# EAGLE schematic miniprinter-sanguinololu-longboard (EAGLE 9.4.2)
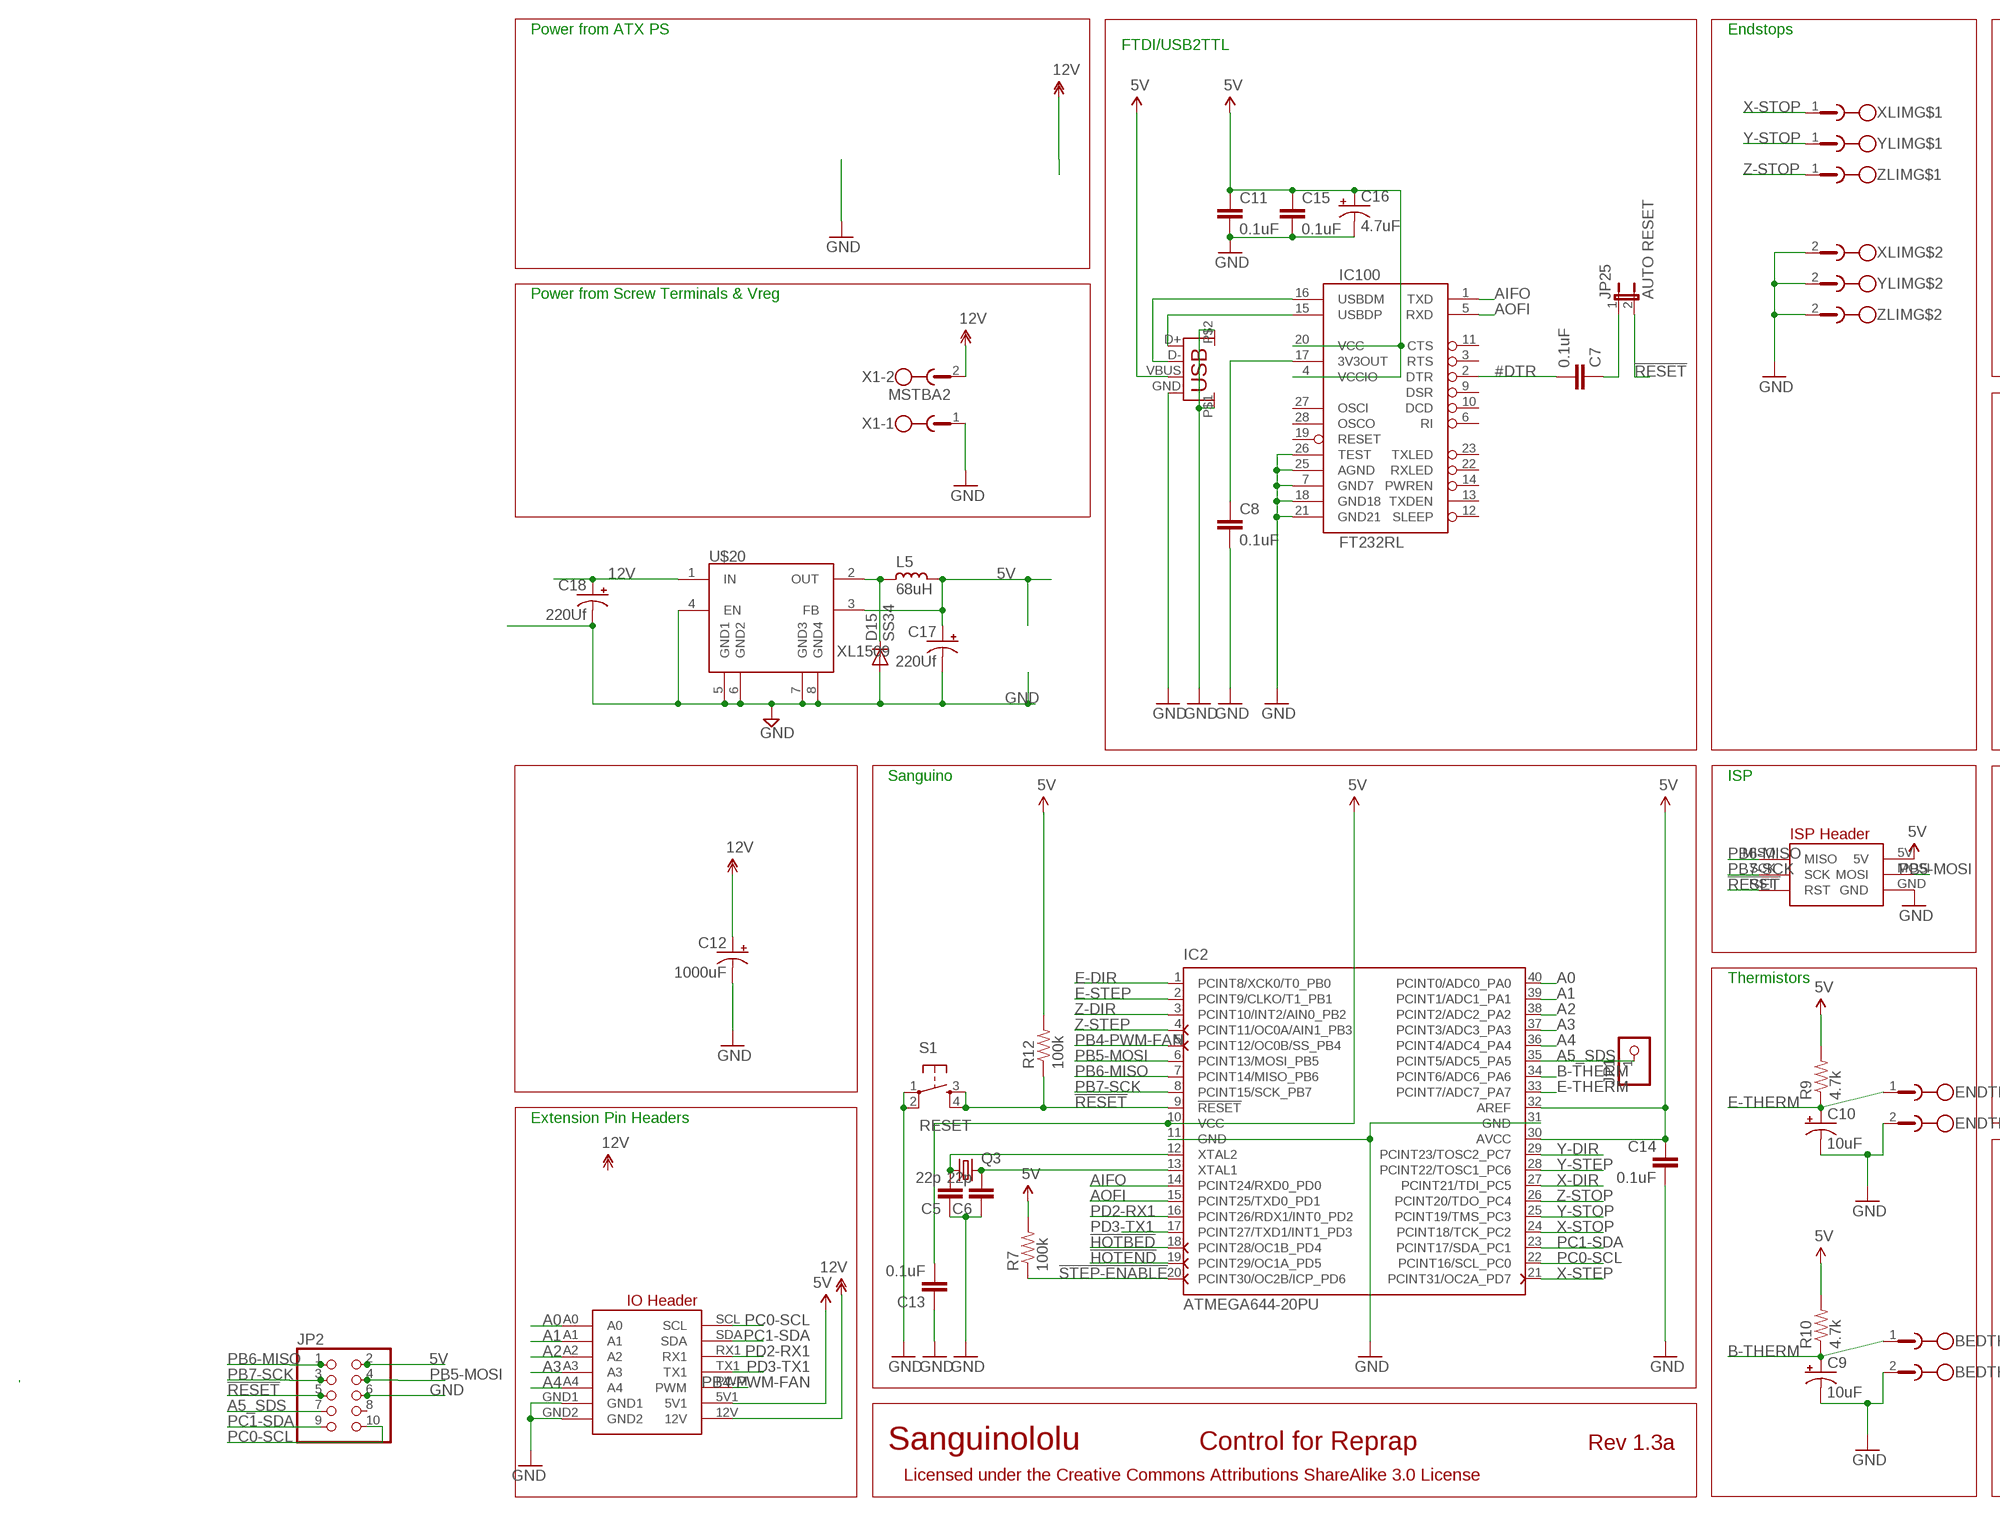
[diagram p0: schematic, sheet 1, part 1 of 2]
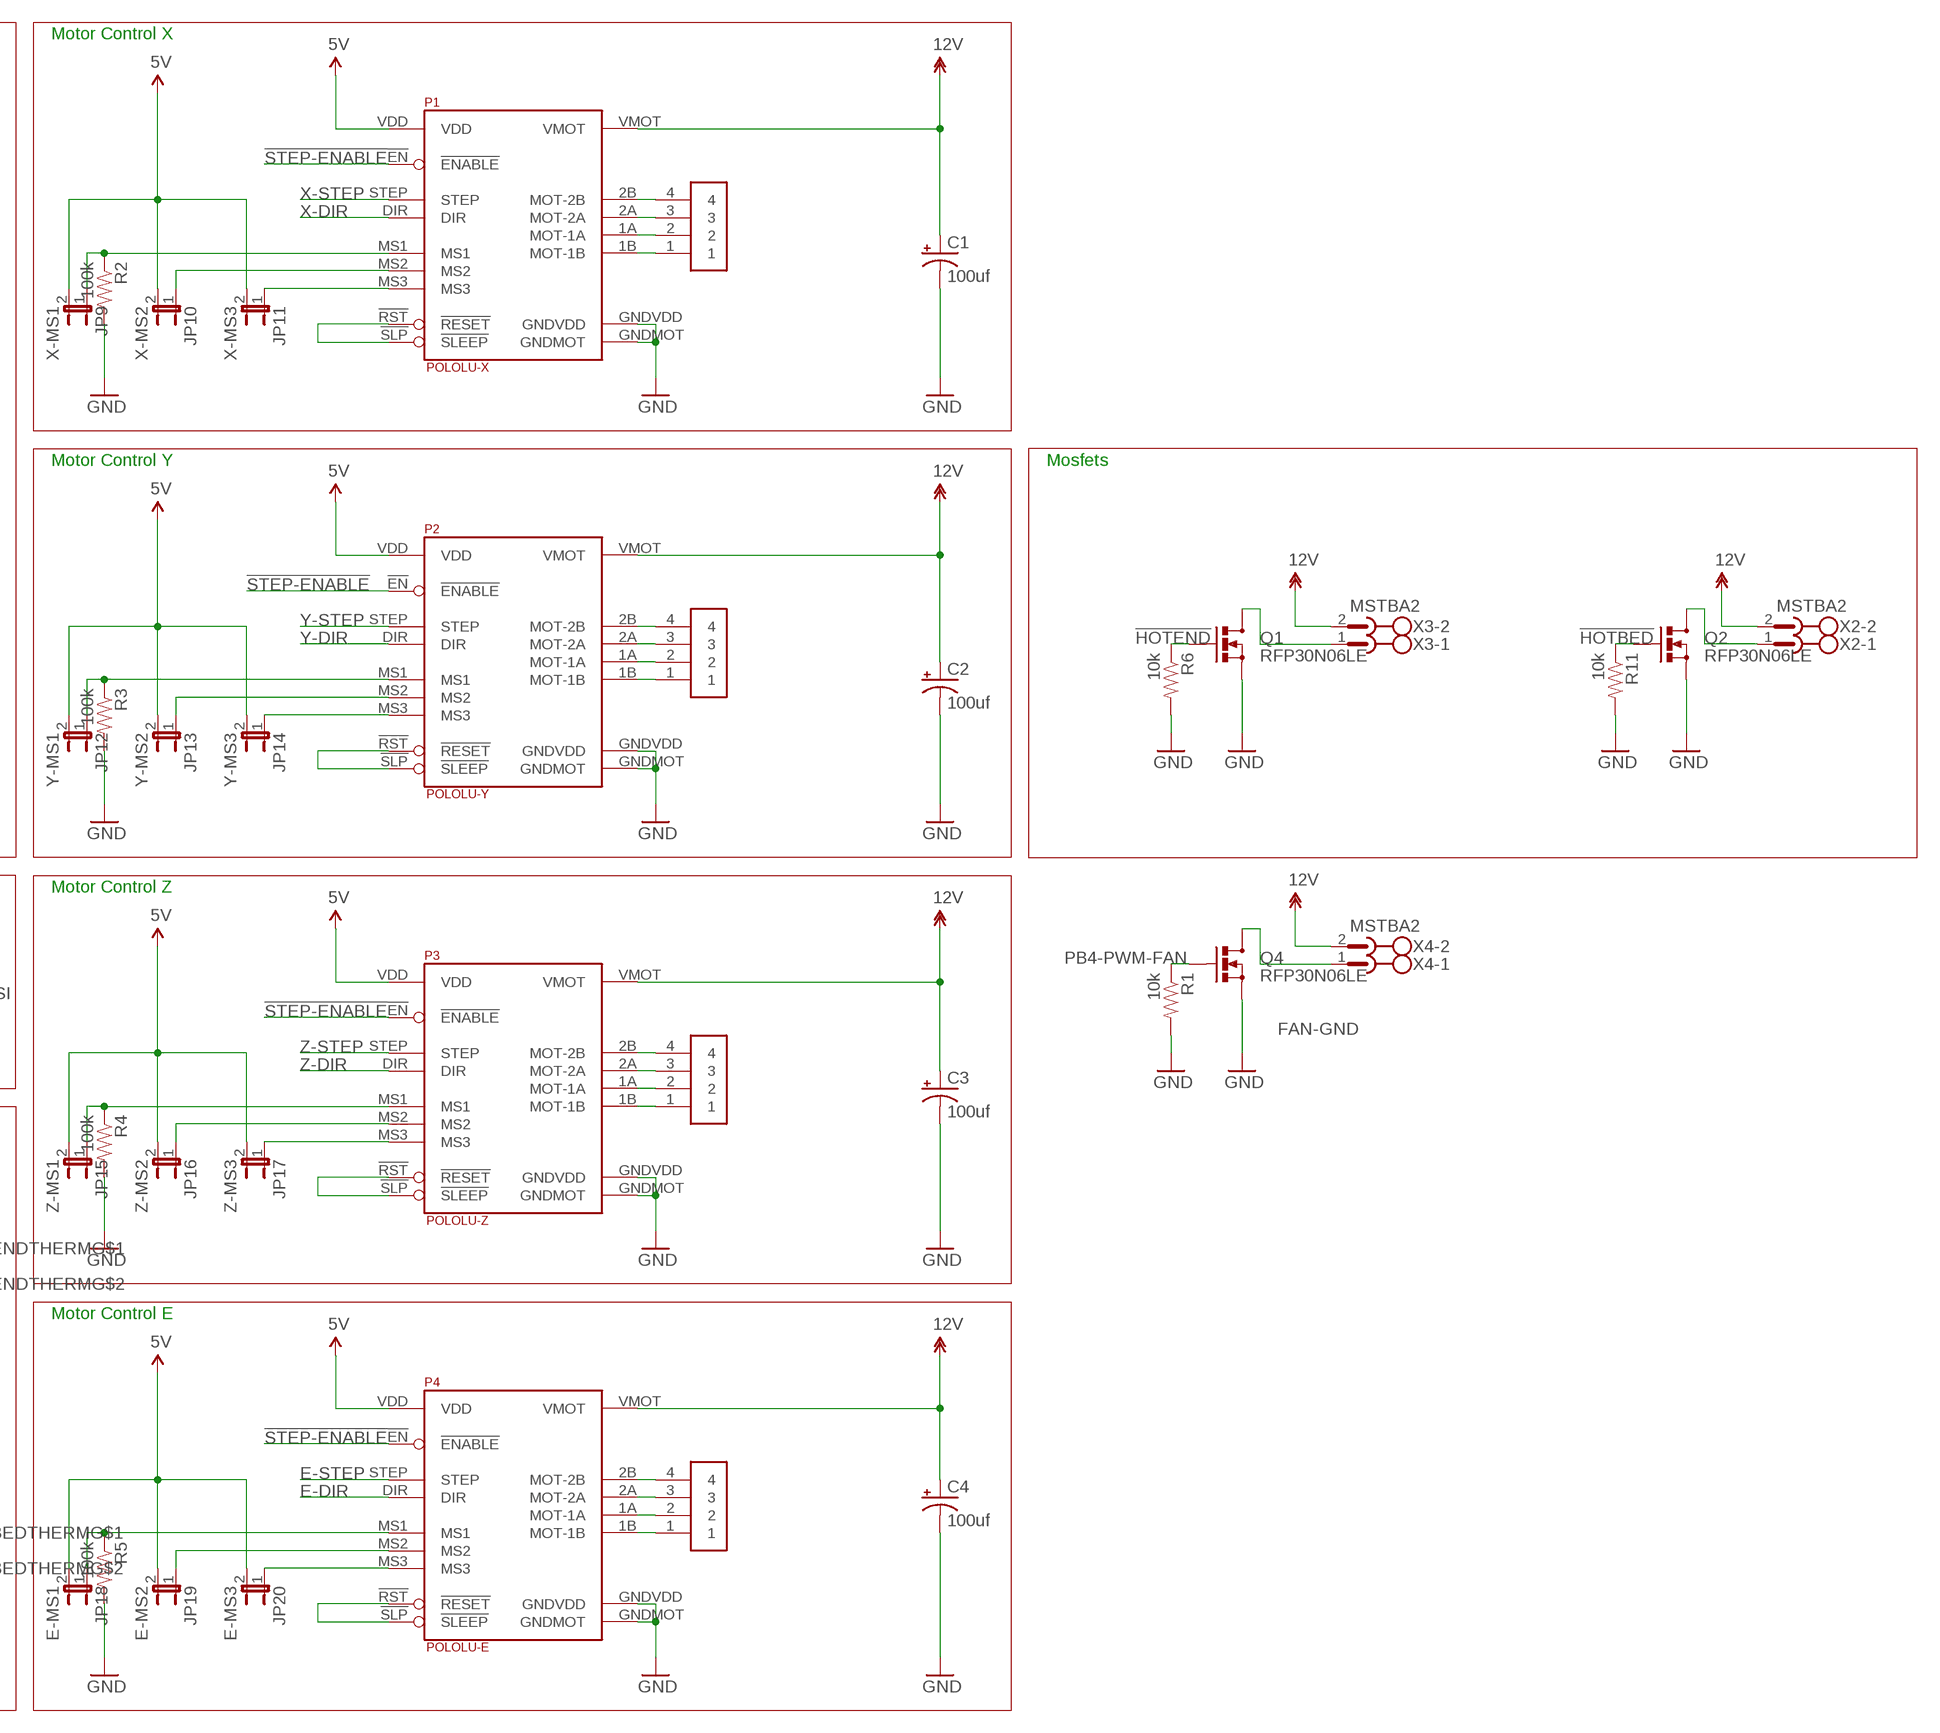
[diagram p1: schematic, sheet 1, part 2 of 2]

## Parts
BEDTHERM  Phoenix Pluggable 3.81mm 2 way  MC1.5/2  [MC1.5/2-G-3.81]
C1  100uf  CAP_POLPTH1  [CPOL-RADIAL-100UF-25V]
C2  100uf  CAP_POLPTH1  [CPOL-RADIAL-100UF-25V]
C3  100uf  CAP_POLPTH1  [CPOL-RADIAL-100UF-25V]
C4  100uf  CAP_POLPTH1  [CPOL-RADIAL-100UF-25V]
C5  22p  CAPPTH2  [CAP-PTH-SMALL2]
C6  22p  CAPPTH2  [CAP-PTH-SMALL2]
C7  0.1uF  CAPPTH2  [CAP-PTH-SMALL2]
C8  0.1uF  CAPPTH2  [CAP-PTH-SMALL2]
C9  10uF  CAP_POLPTH2  [CPOL-RADIAL-10UF-25V]
C10  10uF  CAP_POLPTH2  [CPOL-RADIAL-10UF-25V]
C11  0.1uF  CAPPTH2  [CAP-PTH-SMALL2]
C12  1000uF  CAP_POLPTH4  [CPOL-RADIAL-1000UF-25V]
C13  0.1uF  CAPPTH2  [CAP-PTH-SMALL2]
C14  0.1uF  CAPPTH2  [CAP-PTH-SMALL2]
C15  0.1uF  CAPPTH2  [CAP-PTH-SMALL2]
C16  4.7uF  CAP_POLPTH2  [CPOL-RADIAL-10UF-25V]
C17  220Uf  CAP_POLPTH1  [CPOL-RADIAL-100UF-25V]
C18  220Uf  CAP_POLPTH1  [CPOL-RADIAL-100UF-25V]
D15  SS34  DIODE-DO-214AC  [DO-214AC]
ENDTHERM  Phoenix Pluggable 3.81mm 2 way  MC1.5/2  [MC1.5/2-G-3.81]
IC2  ATMEGA644-20PU  [DIL40]
IC100  FT232RL  FT232RLSSOP  [SSOP28DB]
J1  USB  USBPTH  [USB-B-PTH]
JP1  PINHD-1X1  [1X01]
JP2  PINHD-2X5  [2X05]
JP9  X-MS1  JUMPER-2PTH  [1X02]
JP10  X-MS2  JUMPER-2PTH  [1X02]
JP11  X-MS3  JUMPER-2PTH  [1X02]
JP12  Y-MS1  JUMPER-2PTH  [1X02]
JP13  Y-MS2  JUMPER-2PTH  [1X02]
JP14  Y-MS3  JUMPER-2PTH  [1X02]
JP15  Z-MS1  JUMPER-2PTH  [1X02]
JP16  Z-MS2  JUMPER-2PTH  [1X02]
JP17  Z-MS3  JUMPER-2PTH  [1X02]
JP18  E-MS1  JUMPER-2PTH  [1X02]
JP19  E-MS2  JUMPER-2PTH  [1X02]
JP20  E-MS3  JUMPER-2PTH  [1X02]
JP25  AUTO RESET  JUMPER-2PTH  [1X02]
L5  68uH  L_CD75  [CD75]
P1  POLOLU-X  POLOLU-ALLEGRO  [POLOLU-ALLEGRO-PTH]
P2  POLOLU-Y  POLOLU-ALLEGRO  [POLOLU-ALLEGRO-PTH]
P3  POLOLU-Z  POLOLU-ALLEGRO  [POLOLU-ALLEGRO-PTH]
P4  POLOLU-E  POLOLU-ALLEGRO  [POLOLU-ALLEGRO-PTH]
Q1  RFP30N06LE  MOSFET-NCHANNELPTH2  [TO220V]
Q2  RFP30N06LE  MOSFET-NCHANNELPTH2  [TO220V]
Q3  CRYSTALHC49S  [HC49/S]
Q4  RFP30N06LE  MOSFET-NCHANNELPTH2  [TO220V]
R1  10k  RESISTORPTH1  [AXIAL-0.3]
R2  100k  RESISTORPTH1  [AXIAL-0.3]
R3  100k  RESISTORPTH1  [AXIAL-0.3]
R4  100k  RESISTORPTH1  [AXIAL-0.3]
R5  100k  RESISTORPTH1  [AXIAL-0.3]
R6  10k  RESISTORPTH1  [AXIAL-0.3]
R7  100k  RESISTORPTH1  [AXIAL-0.3]
R9  4.7k  RESISTORPTH1  [AXIAL-0.3]
R10  4.7k  RESISTORPTH1  [AXIAL-0.3]
R11  10k  RESISTORPTH1  [AXIAL-0.3]
R12  100k  RESISTORPTH1  [AXIAL-0.3]
S1  RESET  TAC_SWITCHPTH  [TACTILE-PTH]
U$17  CONNECTOR-M4  [3.81MM-4WAY-PLUGGABLE-SCREW]
U$20  XL1509  [SO08]
U$24  IO_HEADERS_SCREW  [IO_HEADER-PLATEDSCREW]
U$25  CONNECTOR-M4  [3.81MM-4WAY-PLUGGABLE-SCREW]
U$26  CONNECTOR-M4  [3.81MM-4WAY-PLUGGABLE-SCREW]
U$27  CONNECTOR-M4  [3.81MM-4WAY-PLUGGABLE-SCREW]
X1  MSTBA2  [MSTBA2]
X2  MSTBA2  [MSTBA2]
X3  MSTBA2  [MSTBA2]
X4  MSTBA2  [MSTBA2]
XLIM  Phoenix Pluggable 3.81mm 2 way  MC1.5/2  [MC1.5/2-G-3.81]
YLIM  Phoenix Pluggable 3.81mm 2 way  MC1.5/2  [MC1.5/2-G-3.81]
ZLIM  Phoenix Pluggable 3.81mm 2 way  MC1.5/2  [MC1.5/2-G-3.81]

## Nets
3V3: C8.1 IC100.17(3V3OUT)
5V: C11.1 C13.2 C14.1 C15.1 C16.1(+) C17.1(+) IC2.10(VCC) IC2.30(AVCC) IC2.32(AREF) IC100.4(VCCIO) IC100.20(VCC) J1.VBUS JP2.2 JP9.2 JP10.2 JP11.2 JP12.2 JP13.2 JP14.2 JP15.2 JP16.2 JP17.2 JP18.2 JP19.2 JP20.2 L5.1 P1.VDD P2.VDD P3.VDD P4.VDD R7.P$2 R9.P$2 R10.P$2 R12.P$2 U$20.3(FB) U$24.5V U$24.5V1
12V: C1.1(+) C2.1(+) C3.1(+) C4.1(+) C12.1(+) C18.1(+) P1.VMOT P2.VMOT P3.VMOT P4.VMOT U$20.1(IN) U$24.12V X1.2 X2.2 X3.2 X4.2
!FTDI-RESET: C7.1 JP25.1
!HOTBED: IC2.18(PCINT28/OC1B_PD4) Q2.1(G) R11.P$1
!HOTEND: IC2.19(PCINT29/OC1A_PD5) Q1.1(G) R6.P$1
!RESET: IC2.9(!RESET) JP2.5 JP25.2 R12.P$1 S1.3 S1.4 U$24.RST
!STEP-ENABLE: IC2.20(PCINT30/OC2B/ICP_PD6) P1.!EN(!ENABLE) P2.!EN(!ENABLE) P3.!EN(!ENABLE) P4.!EN(!ENABLE) R7.P$1
#DTR: C7.2 IC100.2(DTR)
A0: IC2.40(PCINT0/ADC0_PA0) U$24.A0
A1: IC2.39(PCINT1/ADC1_PA1) U$24.A1
A2: IC2.38(PCINT2/ADC2_PA2) U$24.A2
A3: IC2.37(PCINT3/ADC3_PA3) U$24.A3
A4: IC2.36(PCINT4/ADC4_PA4) U$24.A4
A5_SDS: IC2.35(PCINT5/ADC5_PA5) JP1.1 JP2.7
AIFO: IC2.14(PCINT24/RXD0_PD0) IC100.1(TXD)
AOFI: IC2.15(PCINT25/TXD0_PD1) IC100.5(RXD)
B-THERM: BEDTHERM.1 C9.1(+) IC2.34(PCINT6/ADC6_PA6) R10.P$1
E-DIR: IC2.1(PCINT8/XCK0/T0_PB0) P4.DIR
E-MS1: JP18.1 P4.MS1 R5.P$1
E-MS2: JP19.1 P4.MS2
E-MS3: JP20.1 P4.MS3
E-RESETSLEEP: P4.!RST(!RESET) P4.!SLP(!SLEEP)
E-STEP: IC2.2(PCINT9/CLKO/T1_PB1) P4.STEP
E-THERM: C10.1(+) ENDTHERM.1 IC2.33(PCINT7/ADC7_PA7) R9.P$1
FAN-GND [power]: Q4.2(D) X4.1
GND [power]: BEDTHERM.2 C1.2(-) C2.2(-) C3.2(-) C4.2(-) C5.1 C6.1 C8.2 C9.2(-) C10.2(-) C11.2 C12.2(-) C13.1 C14.2 C15.2 C16.2(-) C17.2(-) C18.2(-) D15.2(A) ENDTHERM.2 IC2.11(GND) IC2.31(GND) IC100.7(GND7) IC100.18(GND18) IC100.21(GND21) IC100.25(AGND) IC100.26(TEST) J1.GND J1.P$1 J1.P$2 JP2.6 P1.GNDMOT P1.GNDVDD P2.GNDMOT P2.GNDVDD P3.GNDMOT P3.GNDVDD P4.GNDMOT P4.GNDVDD Q1.3(S) Q2.3(S) Q4.3(S) R1.P$2 R2.P$2 R3.P$2 R4.P$2 R5.P$2 R6.P$2 R11.P$2 S1.1 S1.2 U$20.4(EN) U$20.5(GND1) U$20.6(GND2) U$20.7(GND3) U$20.8(GND4) U$24.GND U$24.GND1 U$24.GND2 X1.1 XLIM.2 YLIM.2 ZLIM.2
HOTBED-GND [power]: Q2.2(D) X2.1
HOTEND-GND [power]: Q1.2(D) X3.1
N$1: P4.1B(MOT-1B) U$27.1
N$3: P4.1A(MOT-1A) U$27.2
N$4: P4.2A(MOT-2A) U$27.3
N$5: P4.2B(MOT-2B) U$27.4
N$6: P3.1B(MOT-1B) U$26.1
N$7: P3.1A(MOT-1A) U$26.2
N$8: P3.2A(MOT-2A) U$26.3
N$9: P3.2B(MOT-2B) U$26.4
N$10: P2.1B(MOT-1B) U$25.1
N$11: P2.1A(MOT-1A) U$25.2
N$12: P2.2A(MOT-2A) U$25.3
N$13: P2.2B(MOT-2B) U$25.4
N$14: P1.1B(MOT-1B) U$17.1
N$15: P1.1A(MOT-1A) U$17.2
N$16: P1.2A(MOT-2A) U$17.3
N$17: P1.2B(MOT-2B) U$17.4
N$23: D15.1(C) L5.2 U$20.2(OUT)
PB4-PWM-FAN: IC2.5(PCINT12/OC0B/SS_PB4) Q4.1(G) R1.P$1 U$24.PWM
PB5-MOSI: IC2.6(PCINT13/MOSI_PB5) JP2.4 U$24.MOSI
PB6-MISO: IC2.7(PCINT14/MISO_PB6) JP2.1 U$24.MISO
PB7-SCK: IC2.8(PCINT15/SCK_PB7) JP2.3 U$24.SCK
PC0-SCL: IC2.22(PCINT16/SCL_PC0) JP2.10 U$24.SCL
PC1-SDA: IC2.23(PCINT17/SDA_PC1) JP2.9 U$24.SDA
PD2-RX1: IC2.16(PCINT26/RDX1/INT0_PD2) U$24.RX1
PD3-TX1: IC2.17(PCINT27/TXD1/INT1_PD3) U$24.TX1
USBDM: IC100.16(USBDM) J1.D-
USBDP: IC100.15(USBDP) J1.D+
X-DIR: IC2.27(PCINT21/TDI_PC5) P1.DIR
X-MS1: JP9.1 P1.MS1 R2.P$1
X-MS2: JP10.1 P1.MS2
X-MS3: JP11.1 P1.MS3
X-RESETSLEEP: P1.!RST(!RESET) P1.!SLP(!SLEEP)
X-STEP: IC2.21(PCINT31/OC2A_PD7) P1.STEP
X-STOP: IC2.24(PCINT18/TCK_PC2) XLIM.1
XTAL1: C6.2 IC2.13(XTAL1) Q3.2
XTAL2: C5.2 IC2.12(XTAL2) Q3.1
Y-DIR: IC2.29(PCINT23/TOSC2_PC7) P2.DIR
Y-MS1: JP12.1 P2.MS1 R3.P$1
Y-MS2: JP13.1 P2.MS2
Y-MS3: JP14.1 P2.MS3
Y-RESETSLEEP: P2.!RST(!RESET) P2.!SLP(!SLEEP)
Y-STEP: IC2.28(PCINT22/TOSC1_PC6) P2.STEP
Y-STOP: IC2.25(PCINT19/TMS_PC3) YLIM.1
Z-DIR: IC2.3(PCINT10/INT2/AIN0_PB2) P3.DIR
Z-MS1: JP15.1 P3.MS1 R4.P$1
Z-MS2: JP16.1 P3.MS2
Z-MS3: JP17.1 P3.MS3
Z-RESETSLEEP: P3.!RST(!RESET) P3.!SLP(!SLEEP)
Z-STEP: IC2.4(PCINT11/OC0A/AIN1_PB3) P3.STEP
Z-STOP: IC2.26(PCINT20/TDO_PC4) ZLIM.1
Unconnected: IC100.3(RTS) IC100.6(RI) IC100.9(DSR) IC100.10(DCD) IC100.11(CTS) IC100.12(SLEEP) IC100.13(TXDEN) IC100.14(PWREN) IC100.19(RESET) IC100.22(RXLED) IC100.23(TXLED) IC100.27(OSCI) IC100.28(OSCO) JP2.8 U$24.GNDSCREW(GND-SCREW)

## Notes on the sheet
- Power from ATX PS | Endstops | Motor Control X
- FTDI/USB2TTL
- Power from Screw Terminals & Vreg
- Motor Control Y | Mosfets
- Sanguino | ISP | Motor Control Z
- Thermistors
- Extension Pin Headers
- Motor Control E
- Sanguinololu | Control for Reprap | Rev 1.3a
- Licensed under the Creative Commons Attributions ShareAlike 3.0 License

## Library data of the parts
BEDTHERM ENDTHERM XLIM YLIM ZLIM = jt-con-phoenix-3.81:MC1.5/2
C1-C4 C9 C10 C12 C16-C18 = SparkFun:CAP_POL: Capacitor Polarized These are standard SMD and PTH capacitors. Normally 10uF, 47uF, and 100uF in electrolytic and tantalum varieties. Always verify the external diameter of the through hole cap, it varies with capacity, voltage, and manufacturer. The EIA devices should be standard.
C5-C8 C11 C13-C15 = SparkFun:CAP: Capacitor Standard 0603 ceramic capacitor, and 0.1" leaded capacitor.
D15 = dp_devices:DIODE: Various Diode Packages
IC2 = atmel:ATMEGA644-*PU: 8-bit Microcontroller with 64K Bytes In-System Programmable Flash Auto generated by make-symbol-device-package-bsdl.ulp Rev. 34 Source: http://www.atmel.com/dyn/resources/prod_documents/doc2593.pdf; MPN: ATMEGA644-20PU; OC_FARNELL: 1288340; OC_NEWARK: 23M5060
IC100 = SparkFun:FT232RL: USB UART FT232RL 4th Generation USB UART (USB <-> Serial) Controller. Spark Fun Electronics SKU : COM-00650
J1 = SparkFun:USB: USB Connectors USB-B-PTH is fully proven SKU : PRT-00139 USB-miniB is fully proven SKU : PRT-00587 USB-A-PCB is untested. USB-A-H is throughly reviewed, but untested. Spark Fun Electronics SKU : PRT-00437 USB-B-SMT is throughly reviewed, but untested. Needs silkscreen touching up. USB-A-S has not been used/tested USB-MB-H has not been used/tested
JP1 = pinhead:PINHD-1X1: PIN HEADER
JP2 = pinhead:PINHD-2X5: PIN HEADER
JP9-JP20 JP25 = SparkFun:JUMPER-2: Jumper Basic 0.1" spaced jumper. Use with breakaway headers.
L5 = rc-master-smd:L_: INDUCTOR
P1-P4 = pololu-allegro:POLOLU-ALLEGRO
Q1 Q2 Q4 = SparkFun:MOSFET-NCHANNEL
Q3 = crystal:CRYSTAL: CRYSTAL; OC_FARNELL: 1667008; OC_NEWARK: unknown
R1-R7 R9-R12 = SparkFun:RESISTOR: Resistor Basic schematic elements and footprints for 0603, 1206, and PTH 1/10th watt (small) resistors.
S1 = SparkFun:TAC_SWITCH: Momentary Switch Button commonly used for reset or general input. Spark Fun Electronics SKU : COM-00097
U$17 U$25-U$27 = openbuilds-eagle-library:CONNECTOR-M4
U$20 = Cohesion_parts:XL1509
U$24 = Sanguinololu:IO_HEADERS_SCREW
X1-X4 = con-phoenix-508:MSTBA2: PHOENIX; MF: FARNELL; MPN: 1757242; OC_FARNELL: 3705171; OC_NEWARK: 71C4161